# EasyEDA schematic SCH_Better Heating Plate_2022-11-13.json
TITLE: Sheet_1; REV: 1.0; Date: 2022-11-07; Sheet: 1/1; Drawn By: John Molpus; Company: Your Company
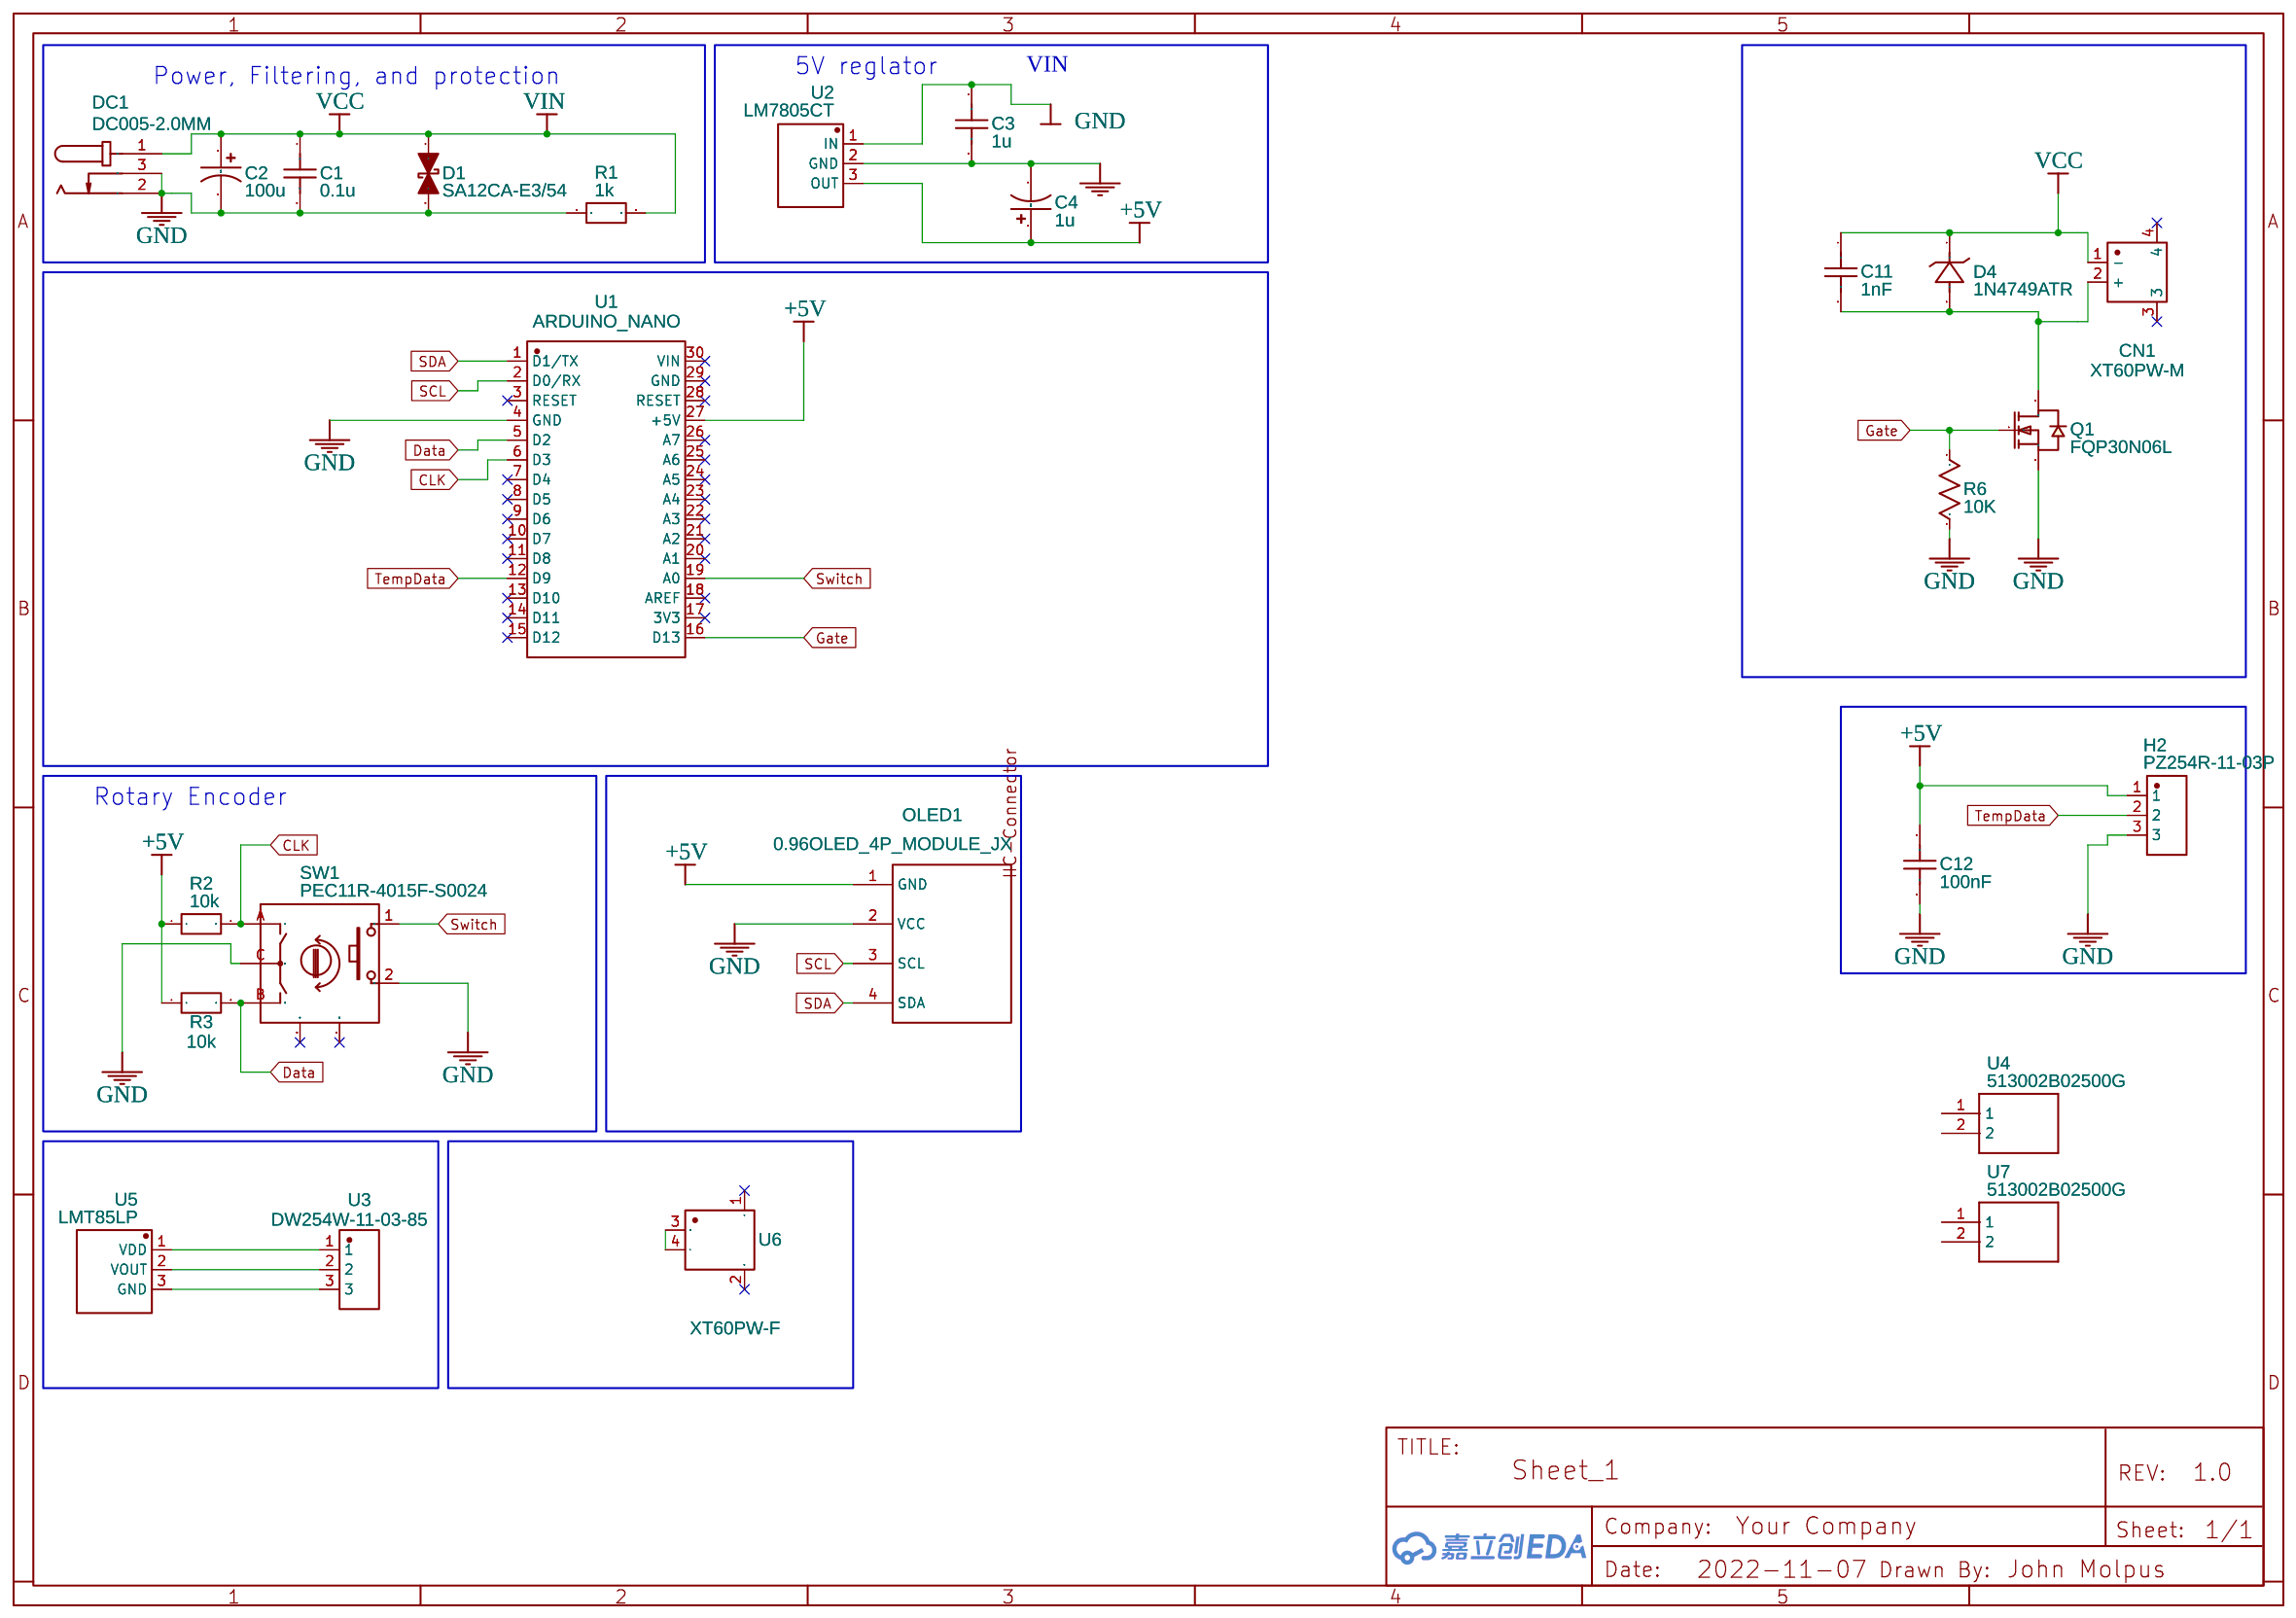
[diagram p0: schematic sheet]

## Parts
C1  0.1u  [RAD-0.2]
C2  100u  [CAP-D3.0×F1.5]
C3  1u  [RAD-0.1]
C4  1u  [CAP-D3.0×F1.5]
C11  1nF  [RAD-0.1]
C12  100nF  [RAD-0.1]
CN1  XT60PW-M  [CONN-TH_XT60PW-M]
D1  SA12CA-E3/54  [DO-15_BD3.4-L6.4-P10.35-D0.8-BI]
D4  1N4749ATR  [DO-41_BD2.4-L4.7-P8.70-D0.8-RD]
DC1  DC005-2.0MM  [DC-IN-TH_DC005]
H2  PZ254R-11-03P  [HDR-TH_3P-P2.54-H-M-W10.4]
OLED1  0.96OLED_4P_MODULE_JX  [0.96OLED_4P]
Q1  FQP30N06L  [TO-220AB-3_L10.3-W5.0-P2.54-L]
R1  1k  [R_AXIAL-0.3]
R2  10k  [R_AXIAL-0.3]
R3  10k  [R_AXIAL-0.3]
R6  10K  [RAD-0.3]
SW1  PEC11R-4015F-S0024  [SW-TH_PEC11R-4XXXF-SXXXX]
U1  ARDUINO_NANO  [COMM-TH_ARDUINO_NANO]
U2  LM7805CT  [TO-220-3_L10.0-W4.5-P2.54-L]
U3  DW254W-11-03-85  [HDR-TH_3P-P2.54-H-F-W10.3-N]
U4  513002B02500G  [513002B02500G]
U5  LMT85LP  [TO-92-3_L4.9-W3.7-P1.27-L]
U6  XT60PW-F  [TH_2P-XT60PW-F]
U7  513002B02500G  [513002B02500G]

## Library data of the parts
C1 = C_RAD-0.2_US: Contributor: LCEDA_Lib
C2 C4 = CE_TH_D3.0×F1.5_US: Contributor: LCEDA_Lib
C3 C11 C12 = C_RAD-0.1_US: Contributor: LCEDA_Lib
CN1 = XT60PW-M: Supplier: LCSC; Supplier Part: C98732; Manufacturer: AMASS(艾迈斯); JLCPCB Part Class: Extended Part; Contributor: LCSC
D1 = SA12CA-E3/54: Supplier: LCSC; Supplier Part: C1975517; Manufacturer: VISHAY(威世); Contributor: LCSC; JLCPCB Part Class: Extended Part
D4 = 1N4749ATR: Supplier: LCSC; Supplier Part: C890088; Manufacturer: onsemi(安森美); link: https://atta.szlcsc.com/upload/public/pdf/source/20181009/C258175_DA035AFC58BF64FEA7E7C840A4D35D50.pdf; Contributor: lcsc
DC1 = DC005-2.0MM: Supplier: LCSC; Manufacturer: SOFNG; Supplier Part: C111567
H2 = PZ254R-11-03P: Supplier: LCSC; Supplier Part: C492411; Manufacturer: XFCN; Contributor: LCSC; JLCPCB Part Class: Extended Part
OLED1 = 0.96OLED_4P_MODULE_JX: Supplier: LCSC; Supplier Part: C9900004566; Manufacturer: null; Contributor: LCSC; JLCPCB Part Class: Extended Part
Q1 = FQP30N06L: Supplier: LCSC; Supplier Part: C878826; Manufacturer: VBsemi(微碧); Manufacturer Part: FQP30N06L-VB; Contributor: LCSC; JLCPCB Part Class: Extended Part
R1-R3 = R_AXIAL-0.3_EU: Contributor: LCEDA_Lib
R6 = R_AXIAL-0.3_US: Contributor: LCEDA_Lib
SW1 = PEC11R-4015F-S0024: Supplier: LCSC; Supplier Part: C143789; Manufacturer: BOURNS; Contributor: LCSC; JLCPCB Part Class: Extended Part
U1 = ARDUINO_NANO: Supplier: LCSC; Supplier Part: C9900017879; Manufacturer: null; JLCPCB Part Class: Extended Part; Contributor: lcsc
U2 = LM7805CT: Supplier: LCSC; Manufacturer: FAIRCHILD; Supplier Part: C22146; JLCPCB Part Class: Extended Part
U3 = DW254W-11-03-85: Supplier: LCSC; Supplier Part: C2935993; Manufacturer: DEALON(德艺隆); Contributor: LCSC; JLCPCB Part Class: Extended Part
U4 U7 = 513002B02500G: Contributor: smokinggun38
U5 = LMT85LP: Supplier: LCSC; Manufacturer: TI; Contributor: LCSC; Supplier Part: C75856; JLCPCB Part Class: Extended Part
U6 = XT60PW-F: Supplier: LCSC; Supplier Part: C9900000737; Manufacturer: null; Manufacturer Part: XT60PW-F 母头 板插卧式; Contributor: LCSC; JLCPCB Part Class: Extended Part

## Nets
+5V: C4.1 C12.1 H2.1 OLED1.1(GND) R2.1 R3.1 U1.27(+5V) U2.3(OUT)
GND: C1.2 C2.2 C3.2 C4.2 C12.2 D1.2(A) DC1.2 DC1.3 H2.3 OLED1.2(VCC) Q1.3(S) R1.1 R6.2 SW1.2 SW1.C U1.4(GND) U2.2(GND)
VCC: C1.1 C2.1 C3.1 C11.1 CN1.1(-) D1.1(K) D4.1(C) DC1.1 R1.2 U2.1(IN)
CLK: R2.2 SW1.A U1.6(D3)
Data: R3.2 SW1.B U1.5(D2)
Gate: Q1.1(G) R6.1 U1.16(D13)
SCL: OLED1.3(SCL) U1.2(D0/RX)
SDA: OLED1.4(SDA) U1.1(D1/TX)
Switch: SW1.1 U1.19(A0)
TempData: H2.2 U1.12(D9)
Net-(C11-2): C11.2 CN1.2(+) D4.2(A) Q1.2(D)
Net-(U3-1): U3.1 U5.1(VDD)
Net-(U3-2): U3.2 U5.2(VOUT)
Net-(U3-3): U3.3 U5.3(GND)
Net-(U6-3): U6.3 U6.4

Not connected (* = marked no-connect by the designer): CN1 3* 4*; SW1 MT1* MT2*; U1 3(RESET)* 7(D4)* 8(D5)* 9(D6)* 10(D7)* 11(D8)* 13(D10)* 14(D11)* 15(D12)* 17(3V3)* 18(AREF)* 20(A1)* 21(A2)* 22(A3)* 23(A4)* 24(A5)* 25(A6)* 26(A7)* 28(RESET)* 29(GND)* 30(VIN)*; U4 1 2; U6 1* 2*; U7 1 2

## Notes on the sheet
- Power, Filtering, and protection
- 5V reglator
- Rotary Encoder
